# EAGLE design b291_rev0 (EAGLE 9.6.2)
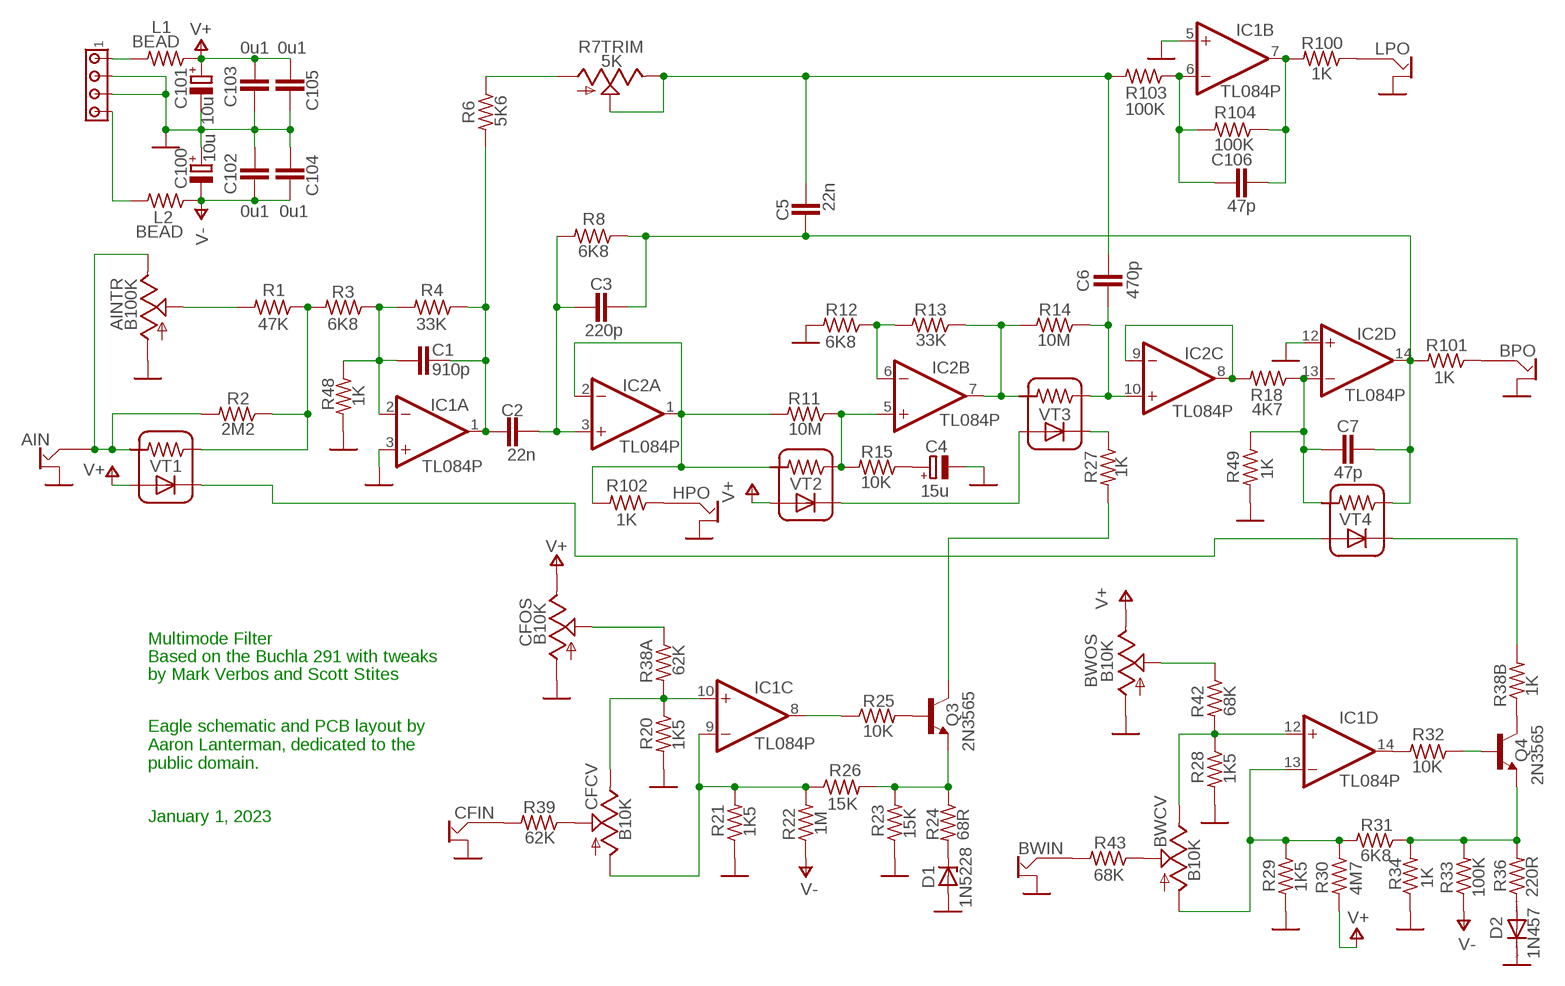
[diagram p0: schematic, sheet 1]

## Parts
AIN  OFFBOARD2JACK  [OFFBOARD2JACK]
AINTR  B100K  TRIM_US-B64Y  [B64Y]
BPO  OFFBOARD2JACK  [OFFBOARD2JACK]
BWCV  B10K  TRIM_US-B64Y  [B64Y]
BWIN  OFFBOARD2JACK  [OFFBOARD2JACK]
BWOS  B10K  TRIM_US-B64Y  [B64Y]
C1  910p  C-EU050-025X075  [C050-025X075]
C2  22n  C-EU050-025X075  [C050-025X075]
C3  220p  C-EU050-025X075  [C050-025X075]
C4  15u  CPOL-EUE1.8-4  [E1,8-4]
C5  22n  C-EU050-025X075  [C050-025X075]
C6  470p  C-EU050-025X075  [C050-025X075]
C7  47p  C-EU050-025X075  [C050-025X075]
C100  10u  CPOL-EUE1.8-4  [E1,8-4]
C101  10u  CPOL-EUE1.8-4  [E1,8-4]
C102  0u1  C-EU050-025X075  [C050-025X075]
C103  0u1  C-EU050-025X075  [C050-025X075]
C104  0u1  C-EU050-025X075  [C050-025X075]
C105  0u1  C-EU050-025X075  [C050-025X075]
C106  47p  C-EU050-025X075  [C050-025X075]
CFCV  B10K  TRIM_US-B64Y  [B64Y]
CFIN  OFFBOARD2JACK  [OFFBOARD2JACK]
CFOS  B10K  TRIM_US-B64Y  [B64Y]
D1  1N5228  ZENER-DIODEDO35Z10  [DO35Z10]
D2  1N457  1N4148DO35-7  [DO35-7]
HPO  OFFBOARD2JACK  [OFFBOARD2JACK]
IC1  TL084P  [DIL14]
IC2  TL084P  [DIL14]
J1  MTA04-156  [1X4MTA]
L1  BEAD  R-US_0309/10  [0309/10]
L2  BEAD  R-US_0309/10  [0309/10]
LPO  OFFBOARD2JACK  [OFFBOARD2JACK]
Q3  2N3565  [TO92]
Q4  2N3565  [TO92]
R1  47K  R-US_0207/10  [0207/10]
R2  2M2  R-US_0207/10  [0207/10]
R3  6K8  R-US_0207/10  [0207/10]
R4  33K  R-US_0207/10  [0207/10]
R6  5K6  R-US_0207/10  [0207/10]
R7TRIM  5K  TRIM_US-B64Y  [B64Y]
R8  6K8  R-US_0207/10  [0207/10]
R11  10M  R-US_0207/10  [0207/10]
R12  6K8  R-US_0207/10  [0207/10]
R13  33K  R-US_0207/10  [0207/10]
R14  10M  R-US_0207/10  [0207/10]
R15  10K  R-US_0207/10  [0207/10]
R18  4K7  R-US_0207/10  [0207/10]
R20  1K5  R-US_0207/10  [0207/10]
R21  1K5  R-US_0207/10  [0207/10]
R22  1M  R-US_0207/10  [0207/10]
R23  15K  R-US_0207/10  [0207/10]
R24  68R  R-US_0207/10  [0207/10]
R25  10K  R-US_0207/10  [0207/10]
R26  15K  R-US_0207/10  [0207/10]
R27  1K  R-US_0207/10  [0207/10]
R28  1K5  R-US_0207/10  [0207/10]
R29  1K5  R-US_0207/10  [0207/10]
R30  4M7  R-US_0207/10  [0207/10]
R31  6K8  R-US_0207/10  [0207/10]
R32  10K  R-US_0207/10  [0207/10]
R33  100K  R-US_0207/10  [0207/10]
R34  1K  R-US_0207/10  [0207/10]
R36  220R  R-US_0207/10  [0207/10]
R38A  62K  R-US_0207/10  [0207/10]
R38B  1K  R-US_0207/10  [0207/10]
R39  62K  R-US_0207/10  [0207/10]
R42  68K  R-US_0207/10  [0207/10]
R43  68K  R-US_0207/10  [0207/10]
R48  1K  R-US_0207/10  [0207/10]
R49  1K  R-US_0207/10  [0207/10]
R100  1K  R-US_0207/10  [0207/10]
R101  1K  R-US_0207/10  [0207/10]
R102  1K  R-US_0207/10  [0207/10]
R103  100K  R-US_0207/10  [0207/10]
R104  100K  R-US_0207/10  [0207/10]
VT1  VACTROLSINGLE  [VACTROLSINGLE]
VT2  VACTROLSINGLE  [VACTROLSINGLE]
VT3  VACTROLSINGLE  [VACTROLSINGLE]
VT4  VACTROLSINGLE  [VACTROLSINGLE]

## Nets
GND: AIN.GND AINTR.A BPO.GND BWIN.GND BWOS.A C4.- C100.+ C101.- C102.1 C103.2 C104.1 C105.2 CFIN.GND CFOS.A D1.A D2.C HPO.GND IC1.3(A:+IN) IC1.5(B:+IN) IC2.12(D:+IN) J1.2 J1.3 LPO.GND R12.2 R20.2 R21.1 R23.1 R28.2 R29.2 R34.1 R48.2 R49.2
N$1: R27.1 VT3.LED-
N$2: IC2.8(C:OUT) IC2.9(C:-IN) R18.2
N$3: C6.1 IC2.10(C:+IN) R14.1 VT3.CELLA(RA)
N$4: IC2.7(B:OUT) R13.1 R14.2 VT3.CELLB(RB)
N$5: IC2.6(B:-IN) R12.1 R13.2
N$6: IC2.5(B:+IN) R11.1 R15.2 VT2.CELLA(RA)
N$7: IC2.1(A:OUT) IC2.2(A:-IN) R11.2 R102.2 VT2.CELLB(RB)
N$8: VT2.LED- VT3.LED+
N$9: Q3.1(C) R27.2
N$10: C2.2 C3.1 IC2.3(A:+IN) R8.2
N$11: C5.2 C6.2 R7TRIM.E R7TRIM.S R103.2
N$12: C3.2 C5.1 C7.2 IC2.14(D:OUT) R8.1 R101.2 VT4.CELLA(RA)
N$13: C1.2 C2.1 IC1.1(A:OUT) R4.1 R6.2
N$14: R6.1 R7TRIM.A
N$15: C1.1 IC1.2(A:-IN) R3.1 R4.2 R48.1
N$16: R38B.2 VT4.LED-
N$17: BPO.SIGNAL R101.1
N$18: Q3.2(B) R25.2
N$19: C7.1 IC2.13(D:-IN) R18.1 R49.1 VT4.CELLB(RB)
N$20: Q3.3(E) R23.2 R24.1 R26.2
N$21: CFCV.A IC1.9(C:-IN) R21.2 R22.2 R26.1
N$22: Q4.1(C) R38B.1
N$23: Q4.2(B) R32.1
N$24: Q4.3(E) R31.1 R33.2 R34.2 R36.2
N$25: BWCV.A IC1.13(D:-IN) R29.1 R30.1 R31.2
N$26: IC1.8(C:OUT) R25.1
N$27: IC1.14(D:OUT) R32.2
N$28: CFCV.E IC1.10(C:+IN) R20.1 R38A.2
N$29: BWCV.E IC1.12(D:+IN) R28.1 R42.2
N$30: CFOS.S R38A.1
N$31: BWOS.S R42.1
N$32: AIN.SIGNAL AINTR.E R2.2 VT1.CELLB(RB)
N$33: J1.1 L1.2
N$34: VT1.LED- VT4.LED+
N$35: AINTR.S R1.2
N$36: D1.C R24.2
N$37: BWIN.SIGNAL R43.2
N$38: BWCV.S R43.1
N$39: CFCV.S R39.1
N$40: CFIN.SIGNAL R39.2
N$41: D2.A R36.1
N$42: C106.1 IC1.6(B:-IN) R103.1 R104.2
N$43: C106.2 IC1.7(B:OUT) R100.2 R104.1
N$44: R1.1 R2.1 R3.2 VT1.CELLA(RA)
N$45: LPO.SIGNAL R100.1
N$46: HPO.SIGNAL R102.1
N$47: C4.+ R15.1
N$60: J1.4 L2.2
V+: BWOS.E C101.+ C103.1 C105.1 CFOS.E L1.1 R30.2 VT1.LED+ VT2.LED+
V-: C100.- C102.2 C104.2 L2.1 R22.1 R33.1

## Notes on the sheet
- Multimode Filter
- Based on the Buchla 291 with tweaks
- by Mark Verbos and Scott Stites
- Eagle schematic and PCB layout by
  Aaron Lanterman, dedicated to the
  public domain.
- January 1, 2023

## Power pins joined to a net without a drawn wire
V+: IC1.4(P:V+) IC2.4(P:V+)
V-: IC1.11(P:V-) IC2.11(P:V-)

## Library data of the parts
AIN BPO BWIN CFIN HPO LPO = aarons_library:OFFBOARD2JACK
AINTR BWCV BWOS CFCV CFOS R7TRIM = pot:TRIM_US-: POTENTIOMETER
C1-C3 C5-C7 C102-C106 = aaroncap:C-EU: CAPACITOR, European symbol
C4 C100 C101 = rcl:CPOL-EU: POLARIZED CAPACITOR, European symbol
D1 = diode:ZENER-DIODE: Z-Diode
D2 = diode:1N4148: DIODE high speed (Philips)
IC1 IC2 = linear:TL084: OP AMP
J1 = con-amp:MTA04-156: AMP connector
L1 L2 R1-R4 R6 R8 R11-R15 R18 R20-R34 R36 R38A R38B R39 R42 R43 R48 R49 R100-R104 = rcl:R-US_: RESISTOR, American symbol
Q3 Q4 = transistor-neu-to92:2N3565: NPN TRANSISTOR
VT1-VT4 = aarons_library:VACTROLSINGLE

## Board
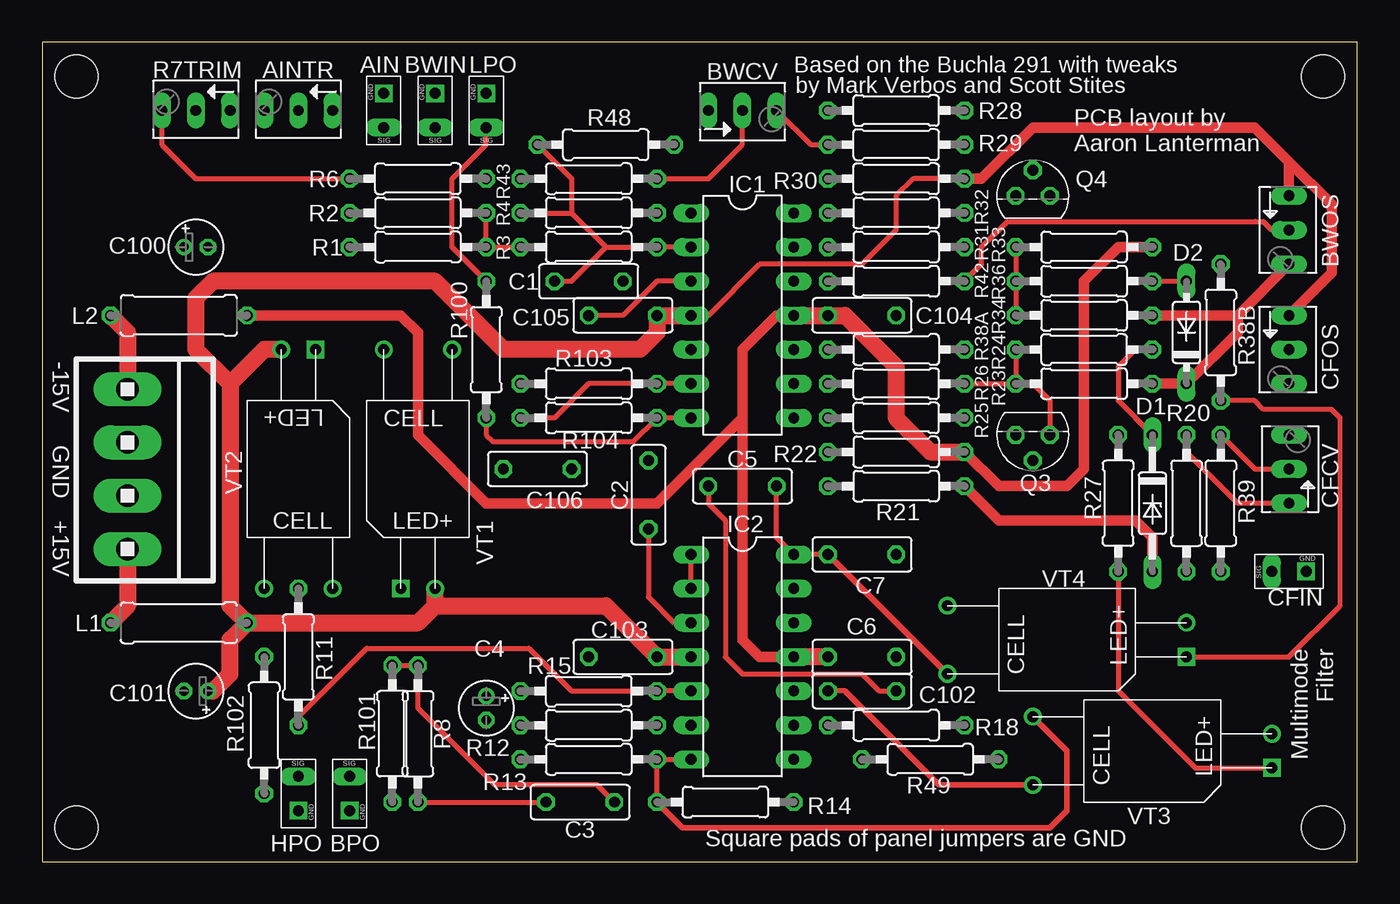
[diagram p1: board, top side]
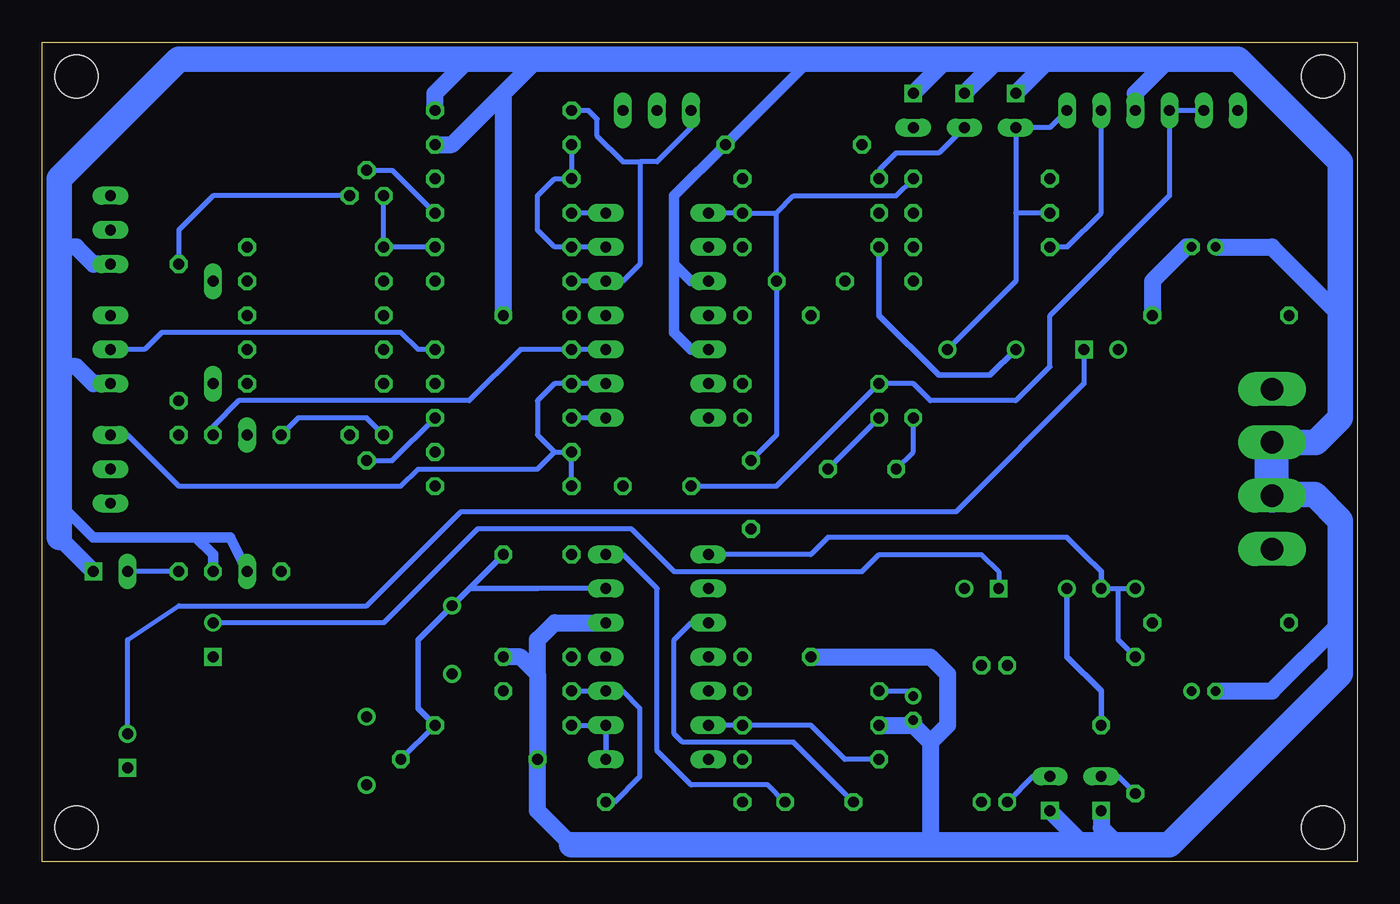
[diagram p2: board, bottom side, seen from below]

Size 97.79 x 60.96 mm. Coordinates in mm from the lower left corner, seen from the top.
Outline: 0,0 97.79,0 97.79,60.96 0,60.96 0,0
Copper layers (1*16): Top 0.035mm / dielectric 1.5mm / Bottom 0.035mm
Design rules "default": minimum track width 10mil, minimum drill 24mil, track to track 8mil, track to pad 8mil, pad to pad 8mil, via to via 8mil, smd to smd 8mil, copper to edge 40mil, drill to drill 8mil, minimum pad ring 10mil, minimum via ring 8mil, stop-mask expansion 4mil, vias tented up to drill 0mil, thermal gap 10mil
Holes 3.2 mm at 2.54,2.54 2.54,58.42 95.25,2.54 95.25,58.42

### Footprints (pad centres in the part's own frame; a part is rotated, then mirrored left to right if it is on the bottom)
OFFBOARD2JACK = drill 0.813 square: GND 0,-1.27 | drill 0.813 long: SIGNAL 0,1.27
B64Y = drill 0.813 long: A 2.54,0; E -2.54,0; S 0,0
C050-025X075 = drill 0.813 octagon: 1 -2.54,0; 2 2.54,0
E1,8-4 = drill 0.711 pad 1.168: + -0.889,0 | drill 0.711 pad 1.168 octagon: - 0.889,0
DO35Z10 = drill 0.813 long: A 5.08,0; C -5.08,0
DO35-7 = drill 0.813 long: A 3.81,0; C -3.81,0
DIL14 = drill 0.813 long: 1 -7.62,-3.81; 2 -5.08,-3.81; 3 -2.54,-3.81; 4 0,-3.81; 5 2.54,-3.81; 6 5.08,-3.81; 7 7.62,-3.81; 8 7.62,3.81; 9 5.08,3.81; 10 2.54,3.81; 11 0,3.81; 12 -2.54,3.81; 13 -5.08,3.81; 14 -7.62,3.81
1X4MTA = drill 1.676 long: 1 5.944,0; 2 1.981,0; 3 -1.981,0; 4 -5.944,0
0309/10 = drill 0.813 octagon: 1 -5.08,0; 2 5.08,0
TO92 = drill 0.813 octagon: 1 1.27,0; 2 0,1.905; 3 -1.27,0
0207/10 = drill 0.813 octagon: 1 -5.08,0; 2 5.08,0
VACTROLSINGLE = drill 0.813: CELLA 8.89,2.54; CELLB 8.89,-2.54; LED+ -8.89,-1.27 | drill 0.813 square: LED- -8.89,1.27

### Placement (x,y rotation side)
AIN  25.4,55.88 180 top
AINTR  19.05,55.88 180 top
BPO  22.86,5.08 0 top
BWCV  52.07,55.88 0 top
BWIN  29.21,55.88 180 top
BWOS  92.71,46.99 270 top
C1  40.64,43.18 0 top
C2  45.09,27.3 270 top
C3  40.01,4.45 0 top
C4  33.02,11.43 270 top
C5  52.07,27.94 180 top
C6  60.96,12.7 0 top
C7  60.96,22.86 180 top
C100  11.43,45.72 0 top
C101  11.43,12.7 180 top
C102  60.96,15.24 180 top
C103  43.18,15.24 180 top
C104  60.96,40.64 180 top
C105  43.18,40.64 180 top
C106  36.83,29.21 180 top
CFCV  92.71,29.21 90 top
CFIN  92.71,21.59 90 top
CFOS  92.71,38.1 270 top
D1  82.55,26.67 270 top
D2  85.09,39.37 90 top
HPO  19.05,5.08 0 top
IC1  52.07,40.64 270 top
IC2  52.07,15.24 270 top
J1  6.35,29.21 270 top
L1  10.16,17.78 180 top
L2  10.16,40.64 180 top
LPO  33.02,55.88 180 top
Q3  73.66,31.75 180 top
Q4  73.66,49.53 0 top
R1  27.94,45.72 180 top
R2  27.94,48.26 180 top
R3  40.64,45.72 180 top
R4  40.64,48.26 180 top
R6  27.94,50.8 0 top
R7TRIM  11.43,55.88 180 top
R8  27.94,9.53 270 top
R11  19.05,15.24 90 top
R12  40.64,10.16 180 top
R13  40.64,7.62 180 top
R14  50.8,4.45 180 top
R15  40.64,12.7 0 top
R18  63.5,10.16 180 top
R20  85.09,26.67 270 top
R21  63.5,27.94 180 top
R22  63.5,30.48 180 top
R23  77.47,35.56 180 top
R24  77.47,38.1 0 top
R25  63.5,33.02 0 top
R26  63.5,35.56 0 top
R27  80.01,26.67 90 top
R28  63.5,55.88 0 top
R29  63.5,53.34 0 top
R30  63.5,50.8 0 top
R31  63.5,45.72 180 top
R32  63.5,48.26 180 top
R33  77.47,45.72 180 top
R34  77.47,40.64 180 top
R36  77.47,43.18 180 top
R38A  63.5,38.1 180 top
R38B  87.63,39.37 270 top
R39  87.63,26.67 270 top
R42  63.5,43.18 180 top
R43  40.64,50.8 180 top
R48  41.91,53.34 0 top
R49  66.04,7.62 180 top
R100  33.02,38.1 270 top
R101  26.04,9.53 90 top
R102  16.51,10.16 90 top
R103  40.64,35.56 180 top
R104  40.64,33.02 180 top
VT1  27.94,29.21 90 top
VT2  19.05,29.21 270 top
VT3  82.55,8.26 180 top
VT4  76.2,16.51 180 top

### Tracks (layer width: path | path; a pad name or v marks a point on that pad's centre or on a via)
GND
  Top 0.381: IC1.3 45.72,43.18 43.18,40.64 C105.2
  Top 0.762: 88.9,40.64 BWOS.A | R34.1 88.9,40.64 | 88.9,40.64 88.9,39.37 D2.C R23.1 | R21.1 71.12,25.4 81.28,25.4 82.55,24.13 D1.A
  Bottom 0.762: IC1.3 49.53,43.18 50.8,44.45 | 50.8,44.45 50.8,49.53 R48.2 40.64,59.69 | D1.A 83.82,24.13 86.36,24.13 | 86.36,24.13 93.98,24.13 96.52,26.67 | R20.2 85.09,22.86 86.36,24.13 | IC1.5 49.53,38.1 50.8,39.37 50.8,44.45
  Bottom 1.27: 96.52,24.13 CFIN.GND | BWOS.A 93.98,44.45 95.25,45.72 96.52,45.72 | CFOS.A 93.98,35.56 95.25,36.83 96.52,36.83 | C101.- 6.35,12.7 1.27,17.78 | BPO.GND 20.32,1.27 | C100.+ 6.35,45.72 1.27,40.64 | C104.1 63.5,57.15 | 63.5,57.15 60.96,59.69 | R28.2 68.58,57.15 66.04,59.69 | R29.2 67.31,53.34 63.5,57.15 | 60.96,13.97 62.23,15.24 C102.1 | 60.96,13.97 R49.2 60.96,3.81 58.42,1.27 | 60.96,13.97 60.96,16.51 59.69,17.78 IC2.12 | 31.75,8.89 31.75,1.27 | HPO.GND 19.05,2.54 17.78,1.27 | AIN.GND 22.86,59.69 | BWIN.GND 26.67,59.69 | LPO.GND 30.48,59.69 | AINTR.A 16.51,57.15 13.97,59.69 | C4.- 33.02,10.16 | C103.2 31.75,15.24 30.48,13.97 30.48,10.16 31.75,8.89 | R12.2 33.02,10.16 | 33.02,10.16 31.75,8.89
  Bottom 1.905: 96.52,24.13 96.52,26.67 96.52,36.83 96.52,45.72 96.52,50.8 87.63,59.69 66.04,59.69 60.96,59.69 40.64,59.69 30.48,59.69 26.67,59.69 22.86,59.69 13.97,59.69 8.89,59.69 1.27,52.07 1.27,40.64 1.27,33.02 3.1,31.19 J1.3 | 58.42,1.27 31.75,1.27 20.32,1.27 17.78,1.27 13.97,1.27 1.27,13.97 1.27,17.78 1.27,25.4 3.17,27.3 6.35,27.3
  Bottom 2.54: J1.3 6.35,27.3 J1.2
N$1
  Top 0.381: R27.1 80.01,12.7 85.72,6.99 VT3.LED-
N$2
  Bottom 0.381: R18.2 IC2.9
  Bottom 0.406: IC2.9 IC2.8
N$3
  Top 0.381: 59.69,12.7 C6.1
  Top 0.406: VT3.CELLA 66.67,5.71 59.69,12.7
  Bottom 0.381: C6.1 IC2.10 54.61,12.7 53.34,11.43 53.34,6.35 55.24,4.45 R14.1
N$4
  Top 0.381: IC2.7 R13.1 R14.2
  Top 0.406: R14.2 47.62,2.54 74.93,2.54 76.2,3.81 76.2,8.26 VT3.CELLB
N$5
  Bottom 0.381: R13.2 38.1,7.62 40.64,10.16 R12.1 IC2.6
N$6
  Top 0.381: IC2.5 R15.2 39.37,12.7 36.2,15.88 24.13,15.88 19.05,10.79 R11.1
  Bottom 0.406: VT2.CELLA 21.59,15.24 19.05,12.7 R11.1
N$7
  Top 0.381: IC2.2 IC2.1
  Bottom 0.381: R11.2 17.78,20.32 | 17.78,20.32 VT2.CELLB | R102.2 17.78,16.51 17.78,20.32 | 20.32,22.86 21.59,24.13 39.37,24.13 40.64,22.86 IC2.1
  Bottom 0.406: 20.32,22.86 19.05,21.59 R11.2
N$8
  Bottom 0.381: VT3.LED+ 91.44,16.51 87.63,19.05 73.66,19.05 66.67,26.04 29.84,26.04 20.32,35.56 VT2.LED-
N$9
  Bottom 0.381: Q3.1 73.66,33.02 78.74,33.02 R27.2
N$10
  Top 0.381: R8.2 C3.1 | C2.2 45.09,19.68 46.99,17.78 IC2.3
  Bottom 0.381: C3.1 41.91,8.89 50.16,8.89 50.8,9.53 50.8,16.51 49.53,17.78 IC2.3
N$11
  Top 0.381: C5.2 49.53,26.67 50.8,25.4 50.8,15.24 52.07,13.97 60.96,13.97 62.23,12.7 C6.2
  Bottom 0.381: R7TRIM.S R7TRIM.E 13.97,49.53 22.86,40.64 22.86,36.83 25.4,34.29 31.75,34.29 33.02,35.56 R103.2 43.18,27.94 C5.2
N$12
  Top 0.381: R101.2 R8.1 27.94,11.43 33.66,5.71 41.27,5.71 C3.2 | C7.2 IC2.14 54.61,24.13 C5.1
  Top 0.406: C7.2 VT4.CELLA
  Bottom 0.381: IC2.14 54.61,22.86 52.07,20.32 52.07,8.26 49.53,5.71 43.81,5.71 C3.2
N$13
  Bottom 0.381: IC1.1 R4.1 43.18,48.26 | C2.1 43.18,31.75 C1.2 43.18,48.26 | 43.18,48.26 41.91,49.53 34.29,49.53 R6.2
N$14
  Top 0.381: R7TRIM.A 8.89,53.34 11.43,50.8 R6.1
N$15
  Top 0.381: IC1.2 R3.1 41.91,45.72 | R4.2 39.37,48.26 | 39.37,48.26 41.91,45.72 | C1.1 39.37,43.18 41.91,45.72 | R48.1 39.37,50.8 39.37,48.26
N$16
  Top 0.381: VT4.LED- 92.71,15.24 96.52,19.05 96.52,33.02 95.89,33.66 90.81,33.66 90.17,34.29 R38B.2
N$17
  Bottom 0.381: BPO.SIGNAL 24.13,6.35 R101.1
N$18
  Bottom 0.381: Q3.2 71.75,29.84 R25.2
N$19
  Bottom 0.381: IC2.13 60.96,20.32 | R49.1 R18.1
  Bottom 0.406: 60.96,20.32 66.04,20.32 VT4.CELLB | R18.1 69.85,11.43 69.85,16.51 VT4.CELLB | C7.1 VT4.CELLB
N$20
  Top 0.381: R24.1 R23.2 | R26.2 R23.2 | R23.2 73.66,35.56 74.93,34.29 Q3.3
N$21
  Bottom 0.381: CFCV.A 91.44,31.75 87.63,27.94 71.12,27.94 69.85,29.21 60.96,29.21 59.69,30.48 | R21.2 R22.2 59.69,30.48 | IC1.9 R26.1 59.69,35.56 60.96,34.29 60.96,31.75 59.69,30.48
N$22
  Bottom 0.381: Q4.1 85.09,49.53 87.63,46.99 R38B.1
N$23
  Bottom 0.381: Q4.2 71.75,51.44 R32.1
N$24
  Top 0.381: R33.2 R36.2 R34.2
  Bottom 0.381: R31.1 R33.2 Q4.3
N$25
  Top 0.381: BWCV.A 57.15,53.34 R29.1
  Bottom 0.381: IC1.13 R31.2 59.69,45.72 60.96,46.99 60.96,49.53 59.69,50.8 R30.1 R29.1
N$26
  Bottom 0.381: IC1.8 R25.1
N$27
  Bottom 0.381: IC1.14 R32.2
N$28
  Top 0.381: CFCV.E 88.9,26.67 85.09,30.48 R20.1
  Bottom 0.381: IC1.10 R38A.2 62.23,38.1 66.04,34.29 83.19,34.29 85.09,32.38 R20.1
N$29
  Bottom 0.381: BWCV.E 49.53,54.61 52.07,52.07 53.34,52.07 | R28.1 57.15,55.88 56.52,55.24 56.52,53.98 54.61,52.07 53.34,52.07 | 53.34,52.07 53.34,44.45 54.61,43.18 IC1.12 R42.2
N$30
  Bottom 0.381: R38A.1 69.85,38.1 71.12,39.37 88.9,39.37 90.17,38.1 CFOS.S
N$31
  Top 0.381: R42.1 69.85,44.45 69.85,45.72 71.75,47.62 90.17,47.62 90.81,47.62 91.44,46.99 BWOS.S
N$32
  Bottom 0.381: VT1.CELLB 27.94,40.64 25.4,43.18 25.4,48.26 | AINTR.E 22.86,54.61 AIN.SIGNAL 25.4,48.26 | R2.2 25.4,48.26
N$33
  Top 1.27: J1.1 6.35,19.05 L1.2
N$34
  Bottom 0.381: VT4.LED+ 72.39,17.78 65.41,24.77 53.98,24.77 50.8,21.59 36.83,21.59 35.56,22.86 27.94,22.86 26.67,21.59 VT1.LED-
N$35
  Bottom 0.381: R1.2 21.59,45.72 19.05,48.26 AINTR.S
N$36
  Top 0.381: R24.2 81.28,38.1 80.01,36.83 80.01,34.29 D1.C
N$37
  Bottom 0.381: BWIN.SIGNAL 31.11,52.7 34.29,52.7 35.56,51.44 R43.2
N$38
  Top 0.381: R43.1 49.53,50.8 52.07,53.34 BWCV.S
N$39
  Top 0.381: R39.1 90.17,29.21 CFCV.S
N$40
  Bottom 0.381: R39.2 CFIN.SIGNAL
N$41
  Top 0.381: R36.1 D2.A
N$42
  Top 0.381: IC1.6 R103.1 40.64,35.56 38.1,33.02 R104.2
  Bottom 0.381: R104.2 C106.1
N$43
  Top 0.381: IC1.7 R104.1 43.94,31.24 33.53,31.24 33.02,31.75 R100.2
  Bottom 0.381: C106.2 33.02,30.48 R100.2
N$44
  Top 0.381: R2.1 R1.1 R3.2
  Bottom 0.406: VT1.CELLA 27.3,36.2 31.11,36.2 35.56,40.64 R3.2
N$45
  Top 0.381: R100.1 30.48,45.72 30.48,50.8 33.02,53.34 LPO.SIGNAL
N$46
  Bottom 0.381: R102.1 17.78,6.35 HPO.SIGNAL
N$47
  Bottom 0.381: R15.1 33.4,12.7 C4.+
N$60
  Top 1.27: L2.2 6.35,39.37 J1.4
V+
  Top 0.381: IC1.4 49.53,40.64 53.34,44.45 60.96,44.45 63.5,46.99 63.5,49.53 64.77,50.8 R30.2
  Top 0.762: R30.2 69.85,50.8 73.66,54.61 90.17,54.61 92.71,52.07 | 92.71,52.07 BWOS.E | CFOS.E 95.89,43.81 95.89,48.9 92.71,52.07
  Top 1.27: VT2.LED+ 16.51,38.1 13.97,35.56 | 13.97,35.56 13.97,19.05 L1.1 | L1.1 27.94,17.78 29.21,19.05 | 29.21,19.05 VT1.LED+ | IC2.4 C103.1 41.91,19.05 29.21,19.05 | IC1.4 C105.1 45.72,39.37 44.45,38.1 34.29,38.1 29.21,43.18 12.7,43.18 11.43,41.91 11.43,38.1 13.97,35.56 | C101.+ 12.7,12.7 13.97,13.97 13.97,16.51 L1.1
V-
  Top 0.762: L2.1 26.67,40.64 27.94,39.37 27.94,31.75 33.02,26.67 45.72,26.67 52.07,33.02 | 52.07,33.02 52.07,38.1 54.61,40.64 IC1.11 | 52.07,33.02 52.07,16.51 53.34,15.24 IC2.11 | R33.1 80.01,45.72 77.47,43.18 77.47,29.21 76.2,27.94 71.12,27.94 R22.1
  Top 1.27: C102.2 IC2.11 | IC1.11 C104.2 59.69,40.64 63.5,36.83 63.5,33.02 66.04,30.48 R22.1
  Bottom 1.27: C100.- 12.7,45.72 15.24,43.18 L2.1

### Text on the board
tNames: Based on the Buchla 291 with tweaks | by Mark Verbos and Scott Stites | PCB layout by / Aaron Lanterman | -15V | GND | +15V | Multimode / Filter | Square pads of panel jumpers are GND